# EAGLE schematic L_A_jumper_bed (EAGLE 9.6.2)
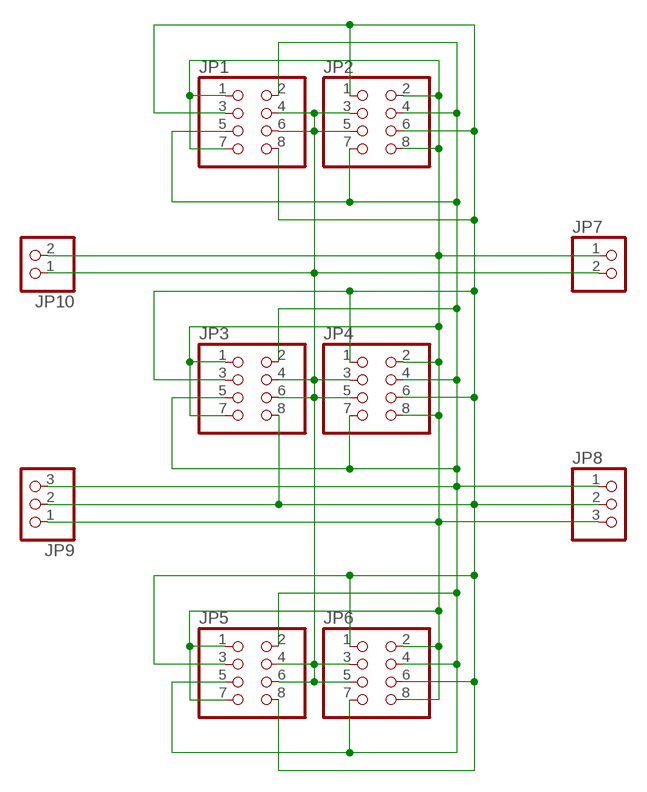
[diagram p0: schematic, sheet 1]

## Parts
JP1  PINHD-2X4  [2X04]
JP2  PINHD-2X4  [2X04]
JP3  PINHD-2X4  [2X04]
JP4  PINHD-2X4  [2X04]
JP5  PINHD-2X4  [2X04]
JP6  PINHD-2X4  [2X04]
JP7  PINHD-1X2/90  [1X02/90]
JP8  PINHD-1X3/90  [1X03/90]
JP9  PINHD-1X31X03/90F  [1X03/90F]
JP10  PINHD-1X21X02/90F  [1X02/90F]

## Nets
GND: JP1.1 JP1.7 JP2.2 JP2.8 JP3.1 JP3.7 JP4.2 JP4.8 JP5.1 JP5.7 JP6.2 JP6.8 JP7.1 JP8.3 JP9.1 JP10.2
SCL: JP1.2 JP1.5 JP2.4 JP2.7 JP3.2 JP3.5 JP4.4 JP4.7 JP5.2 JP5.5 JP6.4 JP6.7 JP8.1 JP9.3
SDA: JP1.3 JP1.8 JP2.1 JP2.6 JP3.3 JP3.8 JP4.1 JP4.6 JP5.3 JP5.8 JP6.1 JP6.6 JP8.2 JP9.2
VCC: JP1.4 JP1.6 JP2.3 JP2.5 JP3.4 JP3.6 JP4.3 JP4.5 JP5.4 JP5.6 JP6.3 JP6.5 JP7.2 JP10.1

## Library data of the parts
JP1-JP6 = pinhead2:PINHD-2X4: PIN HEADER
JP7 JP10 = pinhead2:PINHD-1X2: PIN HEADER
JP8 JP9 = pinhead2:PINHD-1X3: PIN HEADER